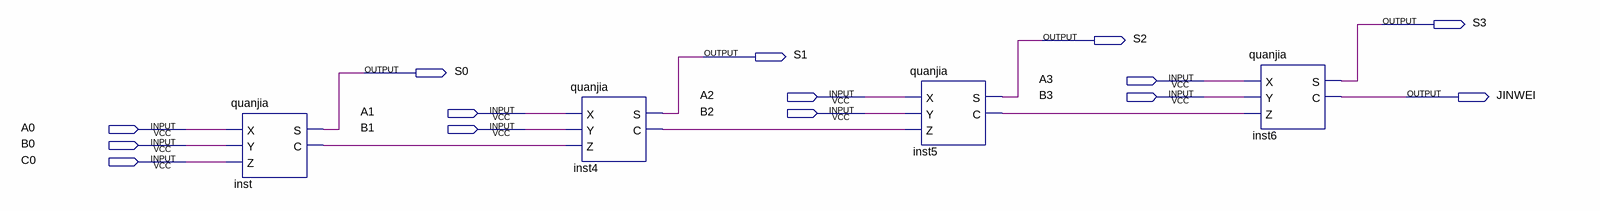
[diagram p0: schematic sheet]
// Quartus schematic bingxing.bdf as structural Verilog: 4 symbols, 14 pins
module bingxing (
  input  A3,
  input  A2,
  input  B3,
  input  A1,
  input  B2,
  input  A0,
  input  B1,
  input  B0,
  input  C0,
  output S3,
  output S2,
  output S1,
  output S0,
  output JINWEI
);

  wire inst4_c, inst5_c, inst_c;

  quanjia inst (.X(A0), .Y(B0), .Z(C0), .S(S0), .C(inst_c));
  quanjia inst4 (.X(A1), .Y(B1), .Z(inst_c), .S(S1), .C(inst4_c));
  quanjia inst5 (.X(A2), .Y(B2), .Z(inst4_c), .S(S2), .C(inst5_c));
  quanjia inst6 (.X(A3), .Y(B3), .Z(inst5_c), .S(S3), .C(JINWEI));
endmodule
